# EasyEDA schematic SCH_Lighting-Strip_2026-09-21(1).json
TITLE: Sheet_1; REV: 1.0; Date: 2026-09-18; Sheet: 1/1; Drawn By: geeejack; Company: Your Company
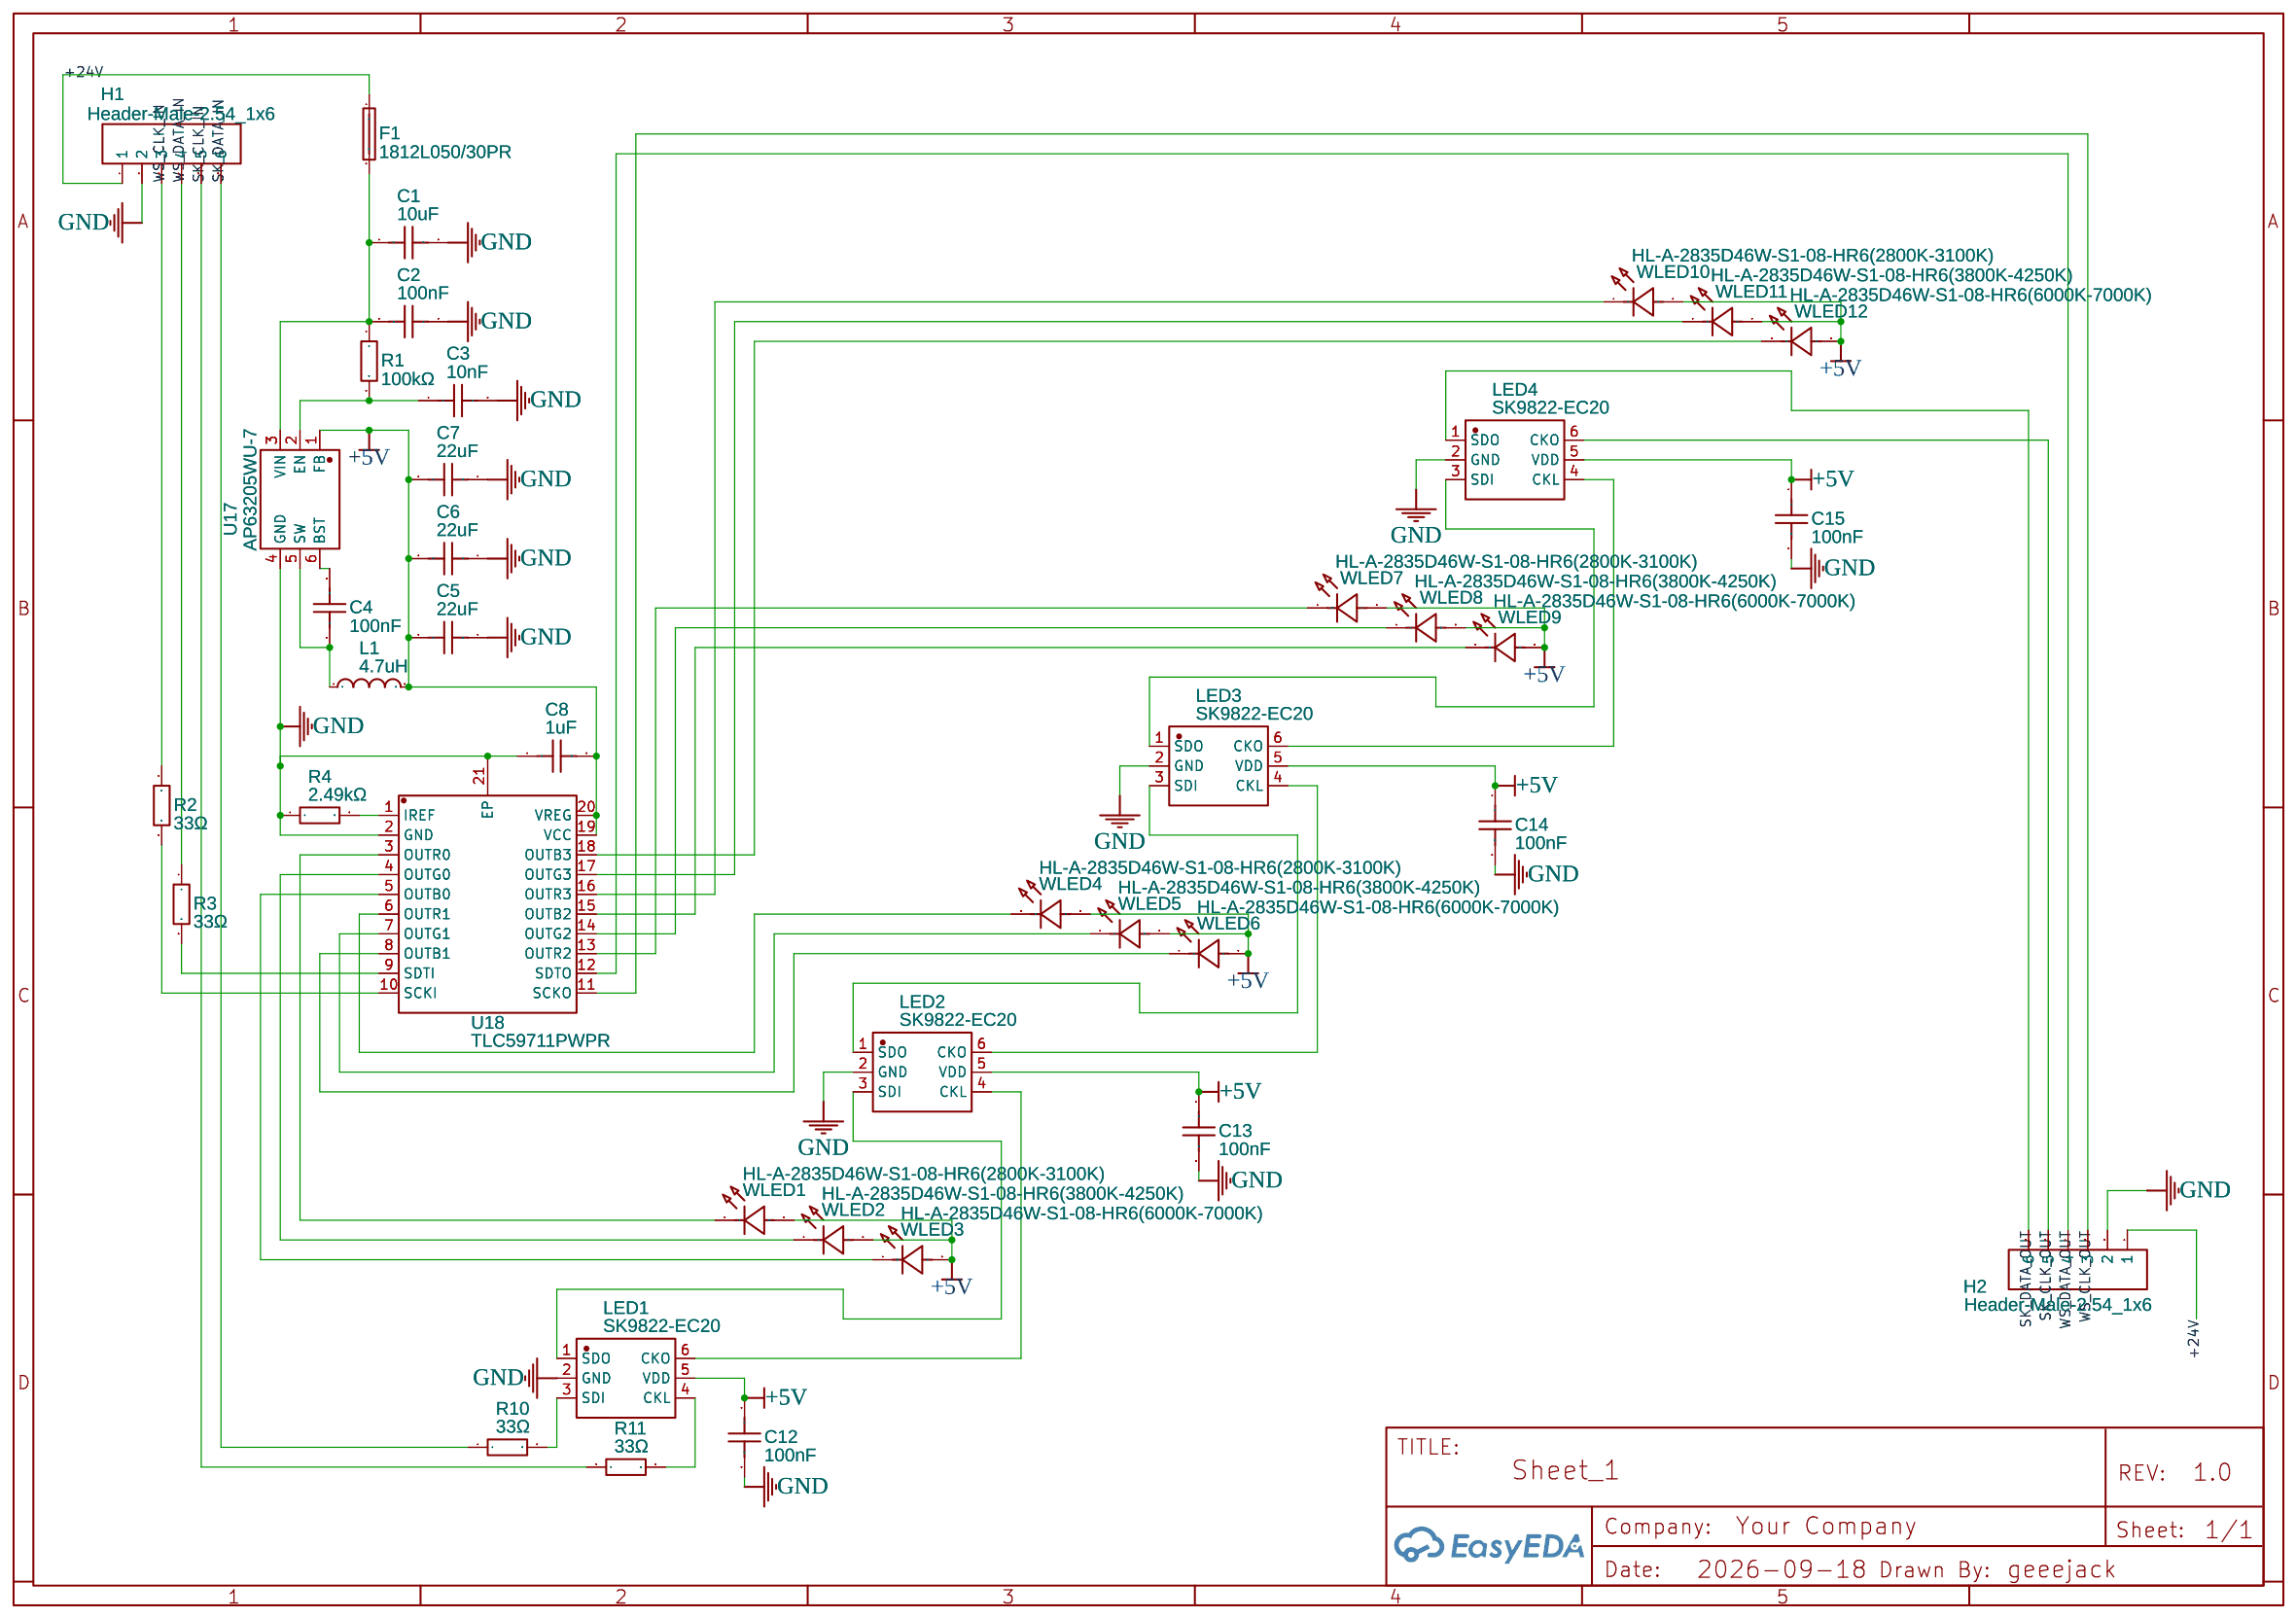
[diagram p0: schematic sheet]

## Parts
C1  10uF  [C1210]
C2  100nF  [C0603]
C3  10nF  [C0603]
C4  100nF  [C0603]
C5  22uF  [C0805]
C6  22uF  [C0805]
C7  22uF  [C0805]
C8  1uF  [C0603]
C12  100nF  [C0603]
C13  100nF  [C0603]
C14  100nF  [C0603]
C15  100nF  [C0603]
F1  1812L050/30PR  [F1812]
H1  Header-Male-2.54_1x6  [HDR-TH_6P-P2.54-V-M-1]
H2  Header-Male-2.54_1x6  [HDR-TH_6P-P2.54-V-M-1]
L1  4.7uH  [IND-SMD_L5.0-W5.0]
LED1  SK9822-EC20  [LED-SMD_6P-L2.0-W2.0-P0.80-TL]
LED2  SK9822-EC20  [LED-SMD_6P-L2.0-W2.0-P0.80-TL]
LED3  SK9822-EC20  [LED-SMD_6P-L2.0-W2.0-P0.80-TL]
LED4  SK9822-EC20  [LED-SMD_6P-L2.0-W2.0-P0.80-TL]
R1  100kΩ  [R0603]
R2  33Ω  [R0603]
R3  33Ω  [R0603]
R4  2.49kΩ  [R0603]
R10  33Ω  [R0603]
R11  33Ω  [R0603]
U17  AP63205WU-7  [TSOT-23-6_L2.9-W1.6-P0.95-LS2.8-BL]
U18  TLC59711PWPR  [HTSSOP-20_L6.5-W4.4-P0.65-LS6.4-BL-EP3.0]
WLED1  HL-A-2835D46W-S1-08-HR6(2800K-3100K)  [LED-SMD_L3.5-W2.8-RD-A]
WLED2  HL-A-2835D46W-S1-08-HR6(3800K-4250K)  [LED-SMD_L3.3-W2.8-RD]
WLED3  HL-A-2835D46W-S1-08-HR6(6000K-7000K)  [LED-SMD_L3.5-W2.8-RD-A]
WLED4  HL-A-2835D46W-S1-08-HR6(2800K-3100K)  [LED-SMD_L3.5-W2.8-RD-A]
WLED5  HL-A-2835D46W-S1-08-HR6(3800K-4250K)  [LED-SMD_L3.3-W2.8-RD]
WLED6  HL-A-2835D46W-S1-08-HR6(6000K-7000K)  [LED-SMD_L3.5-W2.8-RD-A]
WLED7  HL-A-2835D46W-S1-08-HR6(2800K-3100K)  [LED-SMD_L3.5-W2.8-RD-A]
WLED8  HL-A-2835D46W-S1-08-HR6(3800K-4250K)  [LED-SMD_L3.3-W2.8-RD]
WLED9  HL-A-2835D46W-S1-08-HR6(6000K-7000K)  [LED-SMD_L3.5-W2.8-RD-A]
WLED10  HL-A-2835D46W-S1-08-HR6(2800K-3100K)  [LED-SMD_L3.5-W2.8-RD-A]
WLED11  HL-A-2835D46W-S1-08-HR6(3800K-4250K)  [LED-SMD_L3.3-W2.8-RD]
WLED12  HL-A-2835D46W-S1-08-HR6(6000K-7000K)  [LED-SMD_L3.5-W2.8-RD-A]

## Library data of the parts
C1 = CL32B106KBJNNNE: Contributor: LCSC; Supplier: LCSC; Supplier Part: C138687; Manufacturer: SAMSUNG(三星); JLCPCB Part Class: Extended Part
C2 C4 C12-C15 = CC0603KRX7R9BB104: Supplier: LCSC; Manufacturer: YAGEO(国巨); Supplier Part: C14663; JLCPCB Part Class: Basic Part
C3 = 0603B103K500NT: Supplier: LCSC; Manufacturer: FH(风华); Supplier Part: C57112; JLCPCB Part Class: Basic Part
C5-C7 = CL21A226MAQNNNE: Supplier: LCSC; Manufacturer: SAMSUNG(三星); Supplier Part: C45783; JLCPCB Part Class: Basic Part
C8 = CL10A105KB8NNNC: Supplier: LCSC; Manufacturer: SAMSUNG(三星); Supplier Part: C15849; JLCPCB Part Class: Basic Part
F1 = 1812L050/30PR: Contributor: LCSC; Supplier: LCSC; Supplier Part: C151168; Manufacturer: Littelfuse(美国力特); JLCPCB Part Class: Extended Part
H1 H2 = Header-Male-2.54_1x6: Supplier: LCSC; Manufacturer: BOOMELE(博穆精密); Manufacturer Part: 2.54-1x6P直针; Supplier Part: C37208; JLCPCB Part Class: Extended Part
L1 = SWPA5040S4R7NT: Contributor: lcsc; Supplier: LCSC; Supplier Part: C305174; Manufacturer: Sunlord(顺络); JLCPCB Part Class: Extended Part
LED1-LED4 = SK9822-EC20: Contributor: lcsc; Supplier: LCSC; Supplier Part: C2909059; Manufacturer: OPSCO(欧思科); JLCPCB Part Class: Extended Part
R1 = 0603WAF1003T5E: Supplier: LCSC; Manufacturer: UNI-ROYAL(厚声); Supplier Part: C25803; JLCPCB Part Class: Basic Part
R2 R3 R10 R11 = 0603WAF330JT5E: Supplier: LCSC; Manufacturer: UNI-ROYAL(厚声); Supplier Part: C23140; JLCPCB Part Class: Basic Part
R4 = 0603WAF2491T5E: Supplier: LCSC; Manufacturer: UNI-ROYAL(厚声); Supplier Part: C22908; JLCPCB Part Class: Extended Part
U17 = AP63205WU-7: Contributor: LCSC; Supplier: LCSC; Supplier Part: C2071056; Manufacturer: DIODES(美台); JLCPCB Part Class: Extended Part
U18 = TLC59711PWPR: Contributor: LCSC; Supplier: LCSC; Supplier Part: C116842; Manufacturer: TI(德州仪器); JLCPCB Part Class: Extended Part
WLED1 WLED4 WLED7 WLED10 = HL-A-2835D46W-S1-08-HR6(2800K-3100K): Supplier: LCSC; Supplier Part: C5445120; Manufacturer: HONGLITRONIC(鸿利光电); JLCPCB Part Class: Extended Part; Contributor: lcsc
WLED2 WLED5 WLED8 WLED11 = HL-A-2835D46W-S1-08-HR6(3800K-4250K): Supplier: LCSC; Supplier Part: C5445121; Manufacturer: HONGLITRONIC(鸿利光电); Contributor: lcsc
WLED3 WLED6 WLED9 WLED12 = HL-A-2835D46W-S1-08-HR6(6000K-7000K): Supplier: LCSC; Supplier Part: C5445174; Manufacturer: HONGLITRONIC(鸿利光电); Contributor: lcsc; JLCPCB Part Class: Extended Part

## Nets
+5V: C5.2 C6.2 C7.2 C8.2 C12.1 C13.1 C14.1 C15.1 L1.2 LED1.5(VDD) LED2.5(VDD) LED3.5(VDD) LED4.5(VDD) U17.1(FB) U18.19(VCC) U18.20(VREG) WLED1.2(A) WLED2.2(A) WLED3.2(A) WLED4.2(A) WLED5.2(A) WLED6.2(A) WLED7.2(A) WLED8.2(A) WLED9.2(A) WLED10.2(A) WLED11.2(A) WLED12.2(A)
+24V: F1.1 H1.1 H2.1
GND: C1.2 C2.1 C3.2 C5.1 C6.1 C7.1 C8.1 C12.2 C13.2 C14.2 C15.2 H1.2 H2.2 LED1.2(GND) LED2.2(GND) LED3.2(GND) LED4.2(GND) R4.1 U17.4(GND) U18.2(GND) U18.21(EP)
SK_CLK_IN: H1.5 R11.1
SK_CLK_OUT: H2.5 LED4.6(CKO)
SK_DATA_IN: H1.6 R10.1
SK_DATA_OUT: H2.6 LED4.1(SDO)
WS_CLK_IN: H1.3 R2.1
WS_CLK_OUT: H2.3 U18.11(SCKO)
WS_DATA_IN: H1.4 R3.1
WS_DATA_OUT: H2.4 U18.12(SDTO)
Net-(C1-1): C1.1 C2.2 F1.2 R1.1 U17.3(VIN)
Net-(C3-1): C3.1 R1.2 U17.2(EN)
Net-(C4-1): C4.1 L1.1 U17.5(SW)
Net-(C4-2): C4.2 U17.6(BST)
Net-(LED1-1): LED1.1(SDO) LED2.3(SDI)
Net-(LED1-3): LED1.3(SDI) R10.2
Net-(LED1-4): LED1.4(CKL) R11.2
Net-(LED1-6): LED1.6(CKO) LED2.4(CKL)
Net-(LED2-1): LED2.1(SDO) LED3.3(SDI)
Net-(LED2-6): LED2.6(CKO) LED3.4(CKL)
Net-(LED3-1): LED3.1(SDO) LED4.3(SDI)
Net-(LED3-6): LED3.6(CKO) LED4.4(CKL)
Net-(R2-2): R2.2 U18.10(SCKI)
Net-(R3-2): R3.2 U18.9(SDTI)
Net-(R4-2): R4.2 U18.1(IREF)
Net-(U18-3): U18.3(OUTR0) WLED1.1(K)
Net-(U18-4): U18.4(OUTG0) WLED2.1(K)
Net-(U18-5): U18.5(OUTB0) WLED3.1(C)
Net-(U18-6): U18.6(OUTR1) WLED4.1(K)
Net-(U18-7): U18.7(OUTG1) WLED5.1(K)
Net-(U18-8): U18.8(OUTB1) WLED6.1(C)
Net-(U18-13): U18.13(OUTR2) WLED7.1(K)
Net-(U18-14): U18.14(OUTG2) WLED8.1(K)
Net-(U18-15): U18.15(OUTB2) WLED9.1(C)
Net-(U18-16): U18.16(OUTR3) WLED10.1(K)
Net-(U18-17): U18.17(OUTG3) WLED11.1(K)
Net-(U18-18): U18.18(OUTB3) WLED12.1(C)
